# EAGLE design Car (EAGLE 9.2.0)
COMPANY: ADAFRUIT INDUSTRIES; DRAWN: KTOWN; REV: B
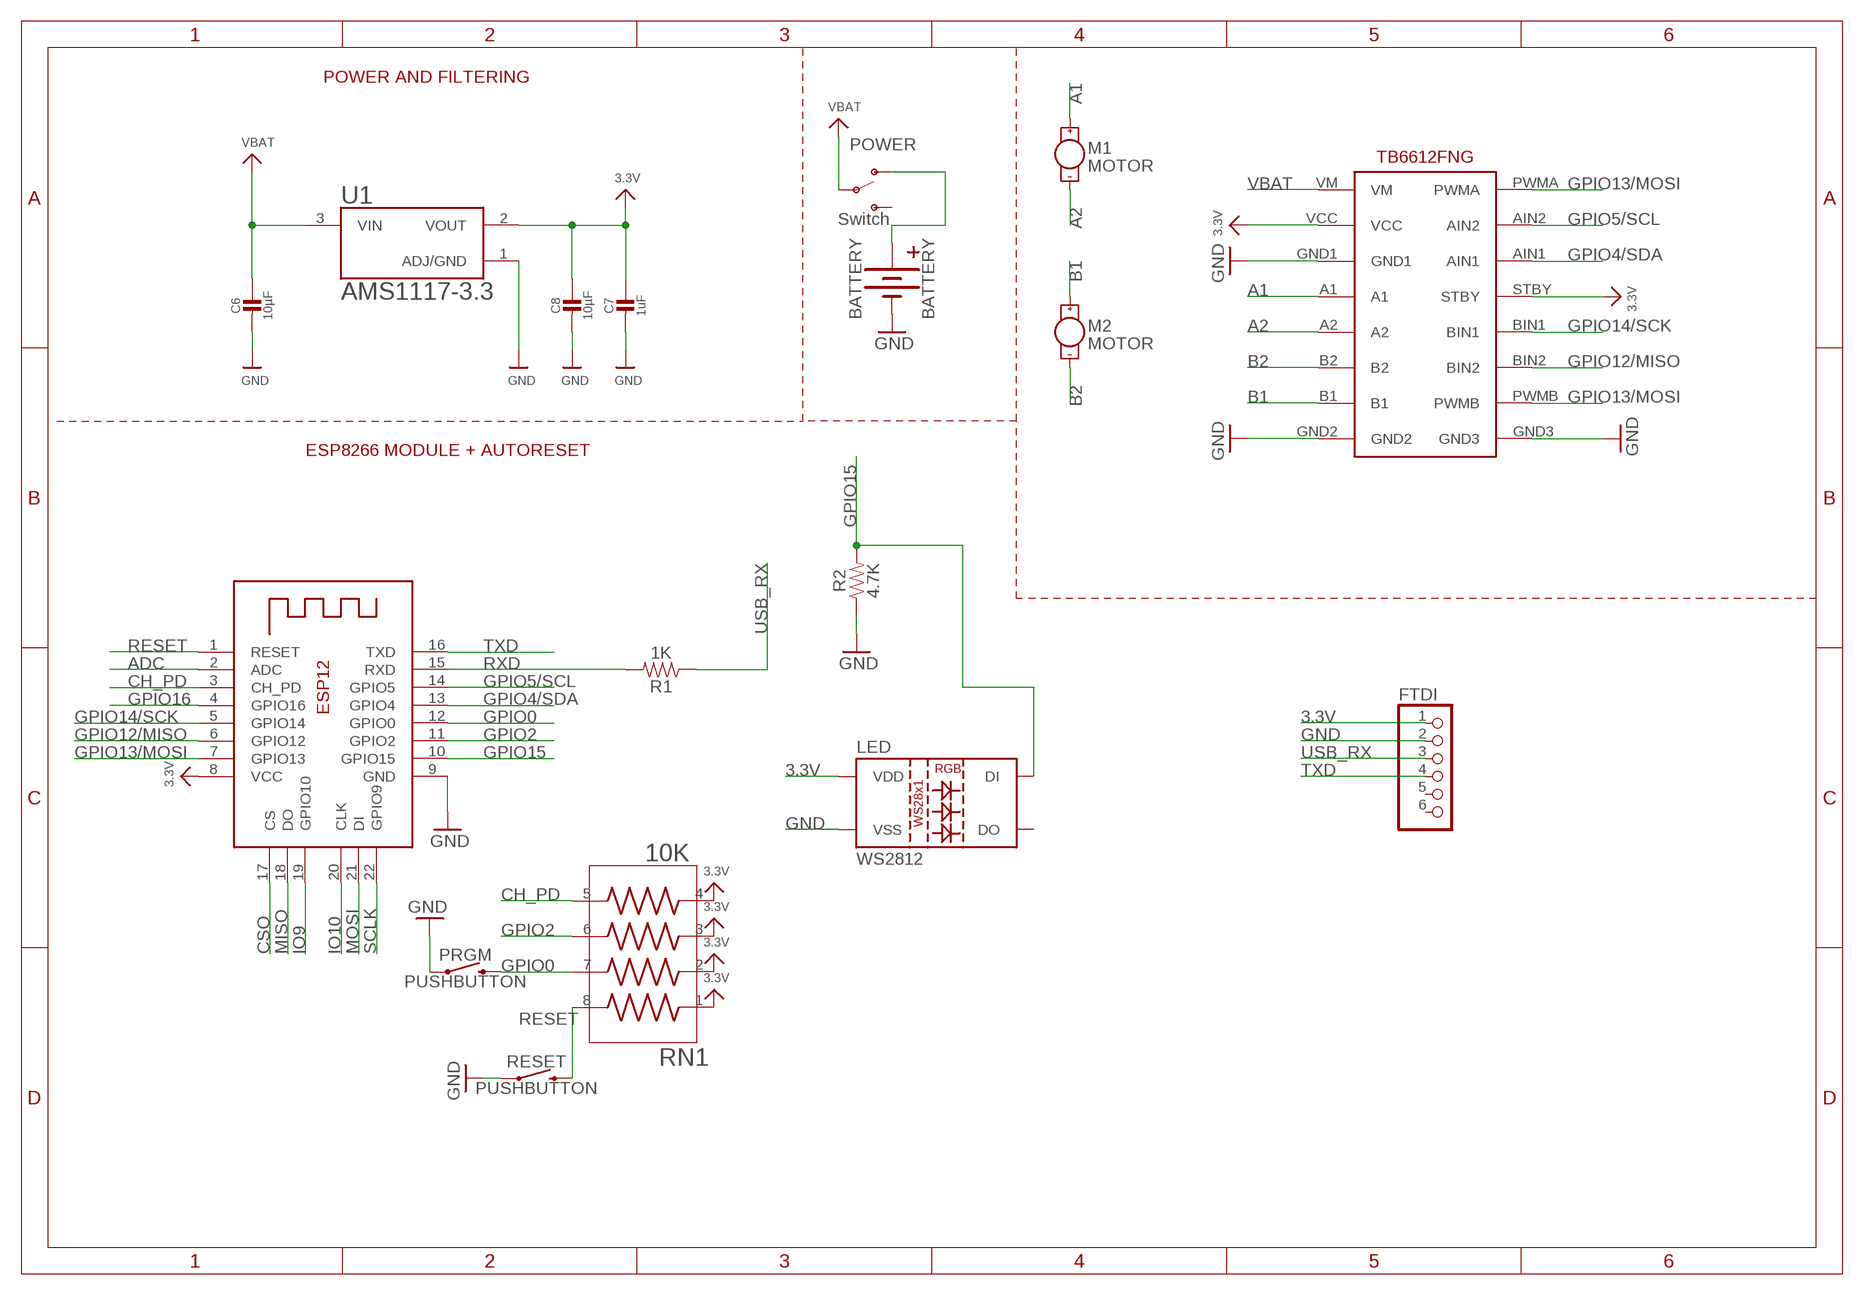
[diagram p0: schematic, sheet 1]

## Parts
BATTERY  BATTERY  [BATTERY-AA-KIT]
C6  10µF  MICROBUILDER_CAP_CERAMIC_0805  [MICROBUILDER__0805]
C7  1uF  MICROBUILDER_CAP_CERAMIC_0603  [MICROBUILDER__0603]
C8  10µF  MICROBUILDER_CAP_CERAMIC_0805  [MICROBUILDER__0805]
FTDI  PINHD-1X6  [1X06]
LED  WS2812  [LED-TRICOLOR-5050-IC]
M1  MOTOR  [1X02_PLUS_MINUS]
M2  MOTOR  [1X02_PLUS_MINUS]
POWER  Switch  SWITCH_SPDT_SLIDE  [SWITCH_SPDT_PTH_11.6X4.0MM]
PRGM  PUSHBUTTON  [TACTILE_SWITCH_SMD_6.0X3.5MM]
R1  1K  RESISTOR1206  [1206]
R2  4.7K  RESISTOR1206  [1206]
RESET  PUSHBUTTON  [TACTILE_SWITCH_SMD_6.0X3.5MM]
RN1  10K  RESISTOR_ARRAY_1206  [RESCAF80P320X160X60-8N]
TB1  TB6612FNG  [TB6612FNG]
U1  AMS1117-3.3  [SOT229P700X180-4N]
X2  ESP-12  ESP-12E  [ESP-12E]

## Nets
3.3V: C7.1 C8.1 FTDI.1 LED.VDD RN1.1 RN1.2 RN1.3 RN1.4 TB1.STBY TB1.VCC U1.2(VOUT) X2.8(VCC)
A1: M1.+ TB1.A1
A2: M1.- TB1.A2
ADC: X2.2(ADC)
B1: M2.+ TB1.B1
B2: M2.- TB1.B2
CH_PD: RN1.5 X2.3(CH_PD)
CSO: X2.17(CS)
GND: BATTERY.GND(-) C6.2 C7.2 C8.2 FTDI.2 LED.VSS PRGM.1 R2.1 RESET.1 TB1.GND1 TB1.GND2 TB1.GND3 U1.1(ADJ/GND) X2.9(GND)
GPIO0: PRGM.2 RN1.7 X2.12(GPIO0)
GPIO2: RN1.6 X2.11(GPIO2)
GPIO4/SDA: TB1.AIN1 X2.13(GPIO4)
GPIO5/SCL: TB1.AIN2 X2.14(GPIO5)
GPIO12/MISO: TB1.BIN2 X2.6(GPIO12)
GPIO13/MOSI: TB1.PWMA TB1.PWMB X2.7(GPIO13)
GPIO14/SCK: TB1.BIN1 X2.5(GPIO14)
GPIO15: LED.DIN(DI) R2.2 X2.10(GPIO15)
GPIO16: X2.4(GPIO16)
IO9: X2.19(GPIO10)
IO10: X2.20(CLK)
MISO: X2.18(DO)
MOSI: X2.21(DI)
N$1: BATTERY.PWR(+) POWER.1(O)
RESET: RESET.2 RN1.8 X2.1(RESET)
RXD: R1.2 X2.15(RXD)
SCLK: X2.22(GPIO9)
TXD: FTDI.4 X2.16(TXD)
USB_RX: FTDI.3 R1.1
VBAT: C6.1 POWER.2(P) TB1.VM U1.3(VIN)
Unconnected: FTDI.5 FTDI.6 LED.DOUT(DO) POWER.3(S)

## Notes on the sheet
- POWER AND FILTERING
- ESP8266 MODULE + AUTORESET

## Library data of the parts
BATTERY = AutoPark:BATTERY
C6-C8 = AutoPark:MICROBUILDER_CAP_CERAMIC: Ceramic Capacitors For new designs, use the packages preceded by an '_' character since they are more reliable: The following footprints should be used on most boards: _0402 - Standard footprint for regular board layouts _0603 - Standard footprint for regular board layouts _0805 - Standard footprint for regular board layouts _1206 - Standard footprint for regular board layouts For extremely tight-pitch boards where space is at a premium, the following 'micro-pitch' footprints can be used (smaller pads, no silkscreen outline, etc.): _0402MP - Micro-pitch footprint for very dense/compact boards _0603MP - Micro-pitch footprint for very dense/compact boards _0805MP - Micro-pitch footprint for very dense/compact boards _1206MP - Micro-pitch footprint for very dense/compact boards
FTDI = pinhead:PINHD-1X6: PIN HEADER
LED = AutoPark:WS2812
M1 M2 = AutoPark:MOTOR
POWER = AutoPark:SWITCH_SPDT_SLIDE: 拨动开关SK12D07VG2/3/4/5/6 侧面5脚拨动带支架 3脚2档柄高6MM Taobao <https://item.taobao.com/item.htm?spm=a1z09.2.0.0.53a62e8d0RVocC&id=563254128682&_u=s1po4ce26496> Dimensional Drawing <https://img.alicdn.com/imgextra/i1/2744920356/TB2568GkMDD8KJjy0FdXXcjvXXa_!!2744920356.jpg>
PRGM RESET = AutoPark:PUSHBUTTON
R1 R2 = SparkFun-Resistors:RESISTOR: Generic Resistor Package
RN1 = AutoPark:RESISTOR_ARRAY_1206: Res Thick Film Array 75 Ohm 5% 0.25W(1/4W) ?200ppm/C ISOL Molded 8-Pin 1206(4 X 0603) Convex SMD T/R; AVAILABILITY: Unavailable; DESCRIPTION: Res Thick Film Array 75 Ohm 5% 0.25W_1/4W_ ?200ppm/C ISOL Molded 8-Pin 1206_4 X 0603_ Convex SMD T/R; MF: Bourns; MP: CAY16-750J4LF; PACKAGE: 1206 Bourns; PRICE: None
TB1 = AutoPark:TB6612FNG
U1 = AutoPark:AMS1117-3.3: Sot223/Pkg 1-Amp 3.3-Volt Low Drop Out Voltage Regulatator; AVAILABILITY: Unavailable; DESCRIPTION: Sot223/Pkg 1-Amp 3.3-Volt Low Drop Out Voltage Regulatator; MF: Advanced Monolithic Systems; MP: AMS1117-3.3; PACKAGE: None; PRICE: None
X2 = microbuilder:ESP-12E

## Board
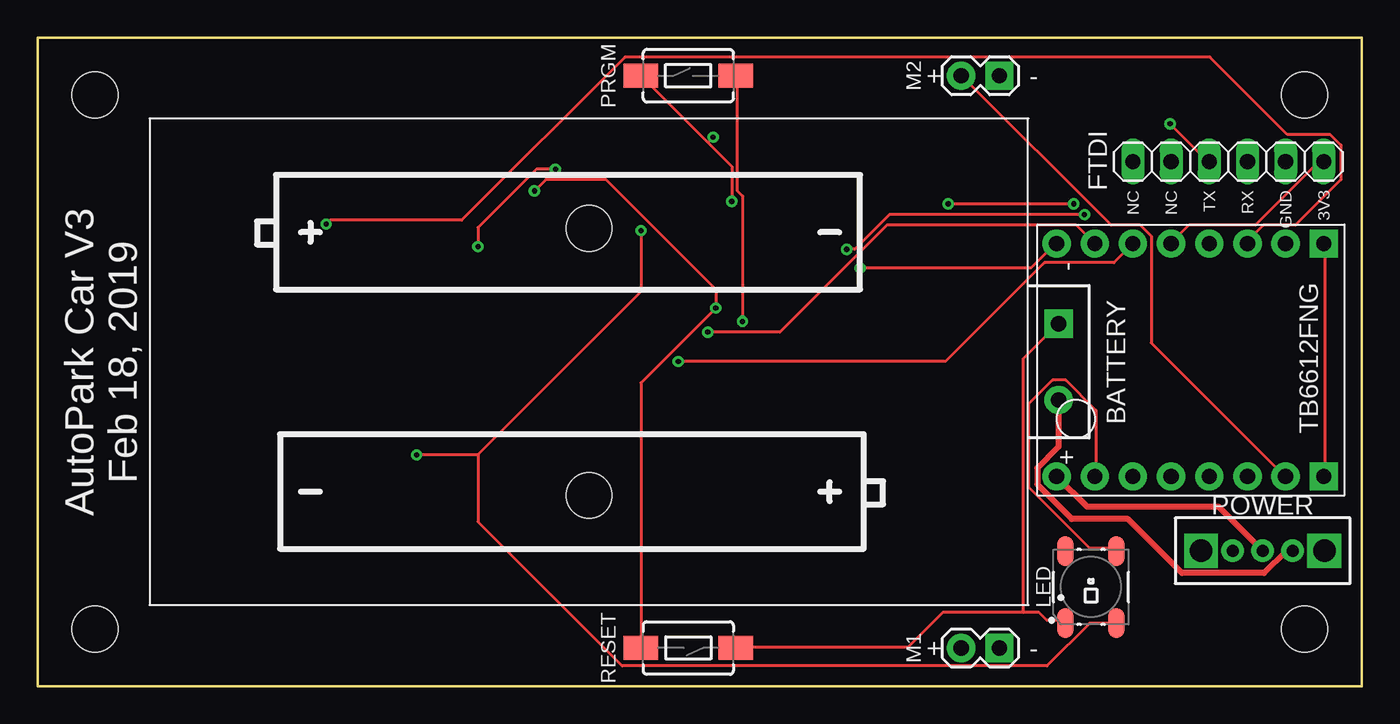
[diagram p1: board, top side]
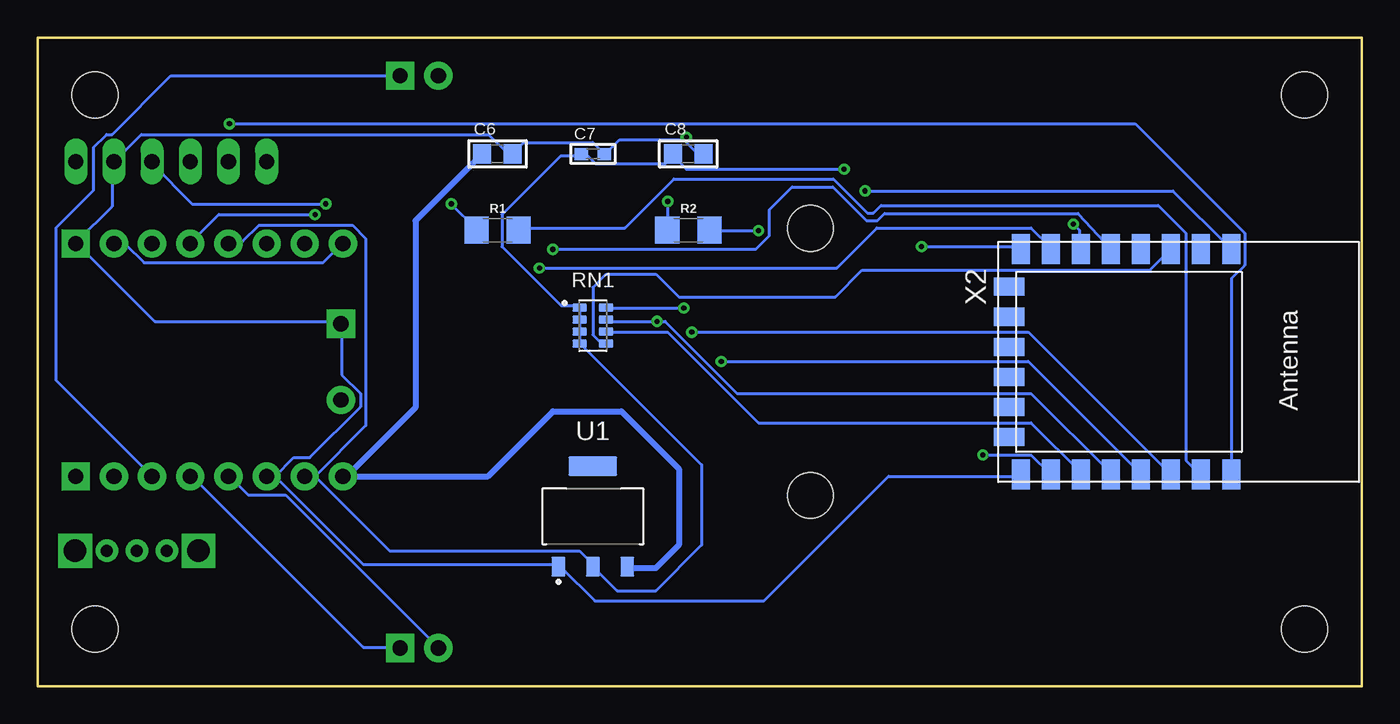
[diagram p2: board, bottom side, seen from below]

Size 88.14 x 43.18 mm. Coordinates in mm from the lower left corner, seen from the top.
Outline: 88.14,43.18 88.14,0 0,0 0,43.18 88.14,43.18
Copper layers (1*16): Top 0.035mm / dielectric 1.5mm / Bottom 0.035mm
Design rules "default *": minimum track width 8mil, minimum drill 0.35mm, track to track 6mil, track to pad 6mil, pad to pad 6mil, via to via 6mil, smd to smd 6mil, copper to edge 40mil, drill to drill 6mil, minimum pad ring 10mil, minimum via ring 8mil, stop-mask expansion 4mil, vias tented up to drill 15mil, thermal gap 10mil
Holes 3.05 mm at 84.33,39.37 3.81,39.37 3.81,3.81 84.33,3.81

### Footprints (pad centres in the part's own frame; a part is rotated, then mirrored left to right if it is on the bottom)
BATTERY-AA-KIT = drill 1.016 pad 1.88 square: GND -31.242,-2.54 | drill 1.016 pad 1.88: PWR -31.242,2.54 | hole 3.048: 0,8.89; 0,-8.89
MICROBUILDER__0805 = smd 1.2 x 1.3: 1 -1.016,0; 2 1.016,0
MICROBUILDER__0603 = smd 0.9 x 0.8: 1 -0.762,0; 2 0.762,0
1X06 = drill 1.016 long: 1 -6.35,0; 2 -3.81,0; 3 -1.27,0; 4 1.27,0; 5 3.81,0; 6 6.35,0
LED-TRICOLOR-5050-IC = smd 2 x 1.1: DIN -2.4,-1.7; DOUT 2.4,1.7; VDD 2.4,-1.7; VSS -2.4,1.7
1X02_PLUS_MINUS = drill 1.016 pad 1.88: + 0,0 | drill 1.016 pad 1.88 square: - 2.54,0
SWITCH_SPDT_PTH_11.6X4.0MM = drill 0.8 pad 1.5: 1 0,2; 2 0,0; 3 0,-2 | drill 1.5 pad 1.8 square: P$1 0,-4.1; P$2 0,4.1
TACTILE_SWITCH_SMD_6.0X3.5MM = smd 2.3 x 1.6: 1 -3.15,0; 2 3.15,0
1206 = smd 1.6 x 1.8: 1 -1.4,0; 2 1.4,0
RESCAF80P320X160X60-8N = smd 0.97 x 0.53: 1 -0.875,1.2; 2 -0.875,0.4; 3 -0.875,-0.4; 4 -0.875,-1.2; 5 0.875,-1.2; 6 0.875,-0.4; 7 0.875,0.4; 8 0.875,1.2
TB6612FNG = drill 1.016 pad 1.88: A1 -7.62,-1.27; A2 -7.62,-3.81; AIN1 7.874,1.27; AIN2 7.874,3.81; B1 -7.62,-8.89; B2 -7.62,-6.35; BIN1 7.874,-3.81; BIN2 7.874,-6.35; GND1 -7.62,1.27; PWMA 7.874,6.35; PWMB 7.874,-8.89; STBY 7.874,-1.27; VCC -7.62,3.81; VM -7.62,6.35 | drill 1.016 pad 1.88 square: GND2 -7.62,-11.43; GND3 7.874,-11.43
SOT229P700X180-4N = smd 0.93 x 1.31: 1 -2.29,-3.345; 2 0,-3.345; 3 2.29,-3.345 | smd 3.24 x 1.31: 4 0,3.345
ESP-12E = smd 2 x 1.2: 1 -7.5,5.77; 2 -7.5,3.77; 3 -7.5,1.77; 4 -7.5,-0.23; 5 -7.5,-2.23; 6 -7.5,-4.23; 7 -7.5,-6.23; 8 -7.5,-8.23; 9 7.5,-8.23; 10 7.5,-6.23; 11 7.5,-4.23; 12 7.5,-2.23; 13 7.5,-0.23; 14 7.5,1.77; 15 7.5,3.77; 16 7.5,5.77 | smd 1.2 x 2: 17 -5,-9; 18 -3,-9; 19 -1,-9; 20 1,-9; 21 3,-9; 22 5,-9

### Placement (x,y rotation side)
BATTERY  36.7,21.59 180 top
C6  57.53,35.43 0 bottom
C7  51.18,35.43 0 bottom
C8  44.83,35.43 0 bottom
FTDI  79.25,34.92 180 top
LED  70.1,6.6 90 top
M1  61.47,2.54 0 top
M2  61.47,40.64 0 top
POWER  81.53,9.02 270 top
PRGM  43.31,40.64 0 top
R1  57.53,30.35 0 bottom
R2  44.83,30.35 0 bottom
RESET  43.31,2.54 180 top
RN1  51.18,24 0 bottom
TB1  74.17,21.59 90 top
U1  51.18,11.3 0 bottom
X2  14.48,21.59 270 bottom

### Tracks (layer width: path | path; a pad name or v marks a point on that pad's centre or on a via)
3.3V  (via drill 0.35)
  Top 0.203: v34.47,34.42 33.2,34.42 29.31,30.53 v29.31,29.26 | FTDI.1 85.5,34.77 85.14,34.77 81.05,30.68 76.61,30.68 75.54,29.62 TB1.STBY | LED.VDD 71.63,9.17 70.03,9.17 65.94,13.26 65.94,18.77 67.54,20.37 68.43,20.37 70.43,18.36 70.43,14.05 TB1.VCC
  Bottom 0.203: 45.85,35.31 46.38,34.77 51,34.77 51.54,35.31 51.89,35.31 C7.1 52.07,35.31 53.32,35.31 57.23,31.39 57.23,29.26 53.32,25.35 52.07,25.35 RN1.1 52.07,25.17 52.07,24.46 RN1.2 52.07,24.28 52.07,23.75 RN1.3 52.07,23.57 52.07,22.86 RN1.4 51.89,22.68 43.94,14.73 43.94,9.4 46.99,6.35 49.57,6.35 U1.2 51.18,8.1 52.07,8.99 64.69,8.99 69.67,13.97 | v29.31,29.26 22.73,29.26 X2.8 | v34.47,34.42 44.96,34.42 45.85,35.31 | C8.1 45.85,35.31 | TB1.VCC 69.67,13.97 | 69.67,13.97 66.29,17.35 66.29,29.79 67.18,30.68 73.41,30.68 74.47,29.62 75.36,29.62 TB1.STBY
A1
  Bottom 0.203: M1.+ 61.49,2.59 71.63,12.72 74.12,12.72 75.36,13.97 TB1.A1
A2
  Bottom 0.203: M1.- 64.16,2.59 66.47,2.59 77.85,13.97 TB1.A2
B1
  Top 0.203: M2.+ 61.49,40.64 71.45,30.68 73.41,30.68 74.12,29.97 74.12,22.86 83.01,13.97 TB1.B1
B2
  Bottom 0.203: M2.- 79.27,40.64 83.18,36.73 83.54,36.73 84.43,35.84 84.43,32.99 86.92,30.5 86.92,20.37 TB1.B2
CH_PD
  Bottom 0.203: RN1.5 50.47,22.86 50.65,22.86 51.18,23.39 51.18,26.54 50.29,27.43 46.99,27.43 45.47,25.91 35.05,25.91 33.27,27.69 14.11,27.69 X2.3
GND  (via drill 0.35)
  Top 0.203: 65.58,4.9 66.65,4.9 67.18,4.37 68.25,4.37 LED.VSS | 65.58,4.9 60.25,4.9 57.94,2.59 46.56,2.59 RESET.1 | v46.2,32.28 46.2,34.59 44.6,36.2 | 44.6,36.2 PRGM.1 | PRGM.1 | v44.96,36.55 44.6,36.2 | TB1.GND2 85.67,13.97 85.67,29.44 TB1.GND3 | 65.58,4.9 65.58,21.79 67.89,24.11 BATTERY.GND
  Bottom 0.203: 72.34,13.97 66.47,8.1 53.49,8.1 U1.1 53.32,7.92 51.05,5.66 39.8,5.66 31.5,13.97 22.73,13.97 X2.9 | TB1.GND1 72.34,13.97 | 72.34,13.97 71.09,15.21 70.03,15.21 66.65,18.59 66.65,19.48 67.89,20.73 67.89,24.11 BATTERY.GND 68.07,24.28 80.34,24.28 85.5,29.44 TB1.GND3 85.5,29.62 83.18,31.93 83.18,34.77 FTDI.2 83.01,34.95 81.23,36.73 58.12,36.73 56.87,35.48 56.52,35.48 | 56.52,35.48 55.8,36.2 51.18,36.2 C7.2 50.29,35.48 49.4,36.37 45.14,36.37 | 45.14,36.37 44.25,35.48 43.89,35.48 C8.2 | v46.2,32.28 46.2,30.5 R2.1 | 45.14,36.37 v44.96,36.55 | 56.52,35.48 C6.2
GPIO0  (via drill 0.35)
  Top 0.203: v46.91,24.28 46.91,32.64 46.56,32.99 46.56,40.64 PRGM.2
  Bottom 0.203: RN1.7 50.29,24.28 v46.91,24.28 46.38,24.28 41.58,19.48 22.02,19.48 16.69,14.15 X2.12
GPIO2
  Bottom 0.203: RN1.6 50.29,23.57 46.2,23.57 40.16,17.53 22.02,17.53 18.64,14.15 X2.11
GPIO4/SDA  (via drill 0.35)
  Top 0.203: v42.65,21.61 60.43,21.61 67,28.19 71.63,28.19 TB1.AIN1
  Bottom 0.203: v42.65,21.61 22.2,21.61 14.73,14.15 X2.13
GPIO5/SCL  (via drill 0.35)
  Top 0.203: v44.6,23.57 49.4,23.57 56.52,30.68 69.14,30.68 TB1.AIN2
  Bottom 0.203: v44.6,23.57 22.2,23.57 12.78,14.15 X2.14
GPIO12/MISO  (via drill 0.35)
  Top 0.203: v19.2,30.76 19.46,31.01 28.22,31.01 39.09,41.88 78.03,41.88 83.18,36.73 86.03,36.73 86.74,36.02 86.74,33.71 83.72,30.68 81.58,30.68 80.52,29.62 TB1.BIN2
  Bottom 0.203: v19.2,30.76 18.82,30.38 18.82,29.26 X2.6
GPIO13/MOSI  (via drill 0.35)
  Top 0.203: v54.74,27.84 66.12,27.84 67.72,29.44 TB1.PWMA
  Bottom 0.203: v54.74,27.84 34.95,27.84 32.28,30.5 22.02,30.5 20.78,29.26 X2.7 | TB1.PWMB 83.01,29.44 82.3,29.44 81.05,28.19 69.14,28.19 67.89,29.44 TB1.PWMA
GPIO14/SCK  (via drill 0.35)
  Top 0.203: v53.85,29.08 54.38,29.08 56.69,31.39 v69.67,31.39
  Bottom 0.203: v53.85,29.08 40.34,29.08 39.45,29.97 39.45,31.7 37.92,33.22 35.2,33.22 32.97,30.99 32.26,30.99 31.78,31.47 18.9,31.47 X2.5 | v69.67,31.39 76.07,31.39 77.85,29.62 TB1.BIN1
GPIO15  (via drill 0.35)
  Top 0.203: 29.29,15.39 40.16,26.26 v40.16,30.33 | 29.29,15.39 v25.22,15.39 | LED.DIN 71.63,4.19 70.03,4.19 67.18,1.35 38.91,1.35 29.31,10.95 29.31,15.39 29.29,15.39
  Bottom 0.203: v40.16,30.33 43.36,30.33 R2.2 | v25.22,15.39 22.02,15.39 20.78,14.15 X2.10
N$1
  Top 0.406: POWER.1 83.1,9.02 81.62,7.54 76.16,7.54 72.57,11.12 68.83,11.12 66.52,13.43 66.52,14.51 67.94,15.93 BATTERY.PWR
RESET  (via drill 0.35)
  Top 0.203: RESET.2 40.16,2.59 40.16,20.19 v45.14,25.17 45.14,26.42 37.82,33.73 33.83,33.73 v33.07,32.97
  Bottom 0.203: v45.14,25.17 50.29,25.17 RN1.8 | v33.07,32.97 12.57,32.97 8.87,29.26 X2.1
RXD
  Bottom 0.203: R1.2 55.98,30.5 49.05,30.5 45.8,33.76 35.18,33.76 32.92,31.5 32.51,31.5 32,32 13.56,32 11.71,30.15 11.71,15.04 10.82,14.15 X2.15
TXD  (via drill 0.35)
  Top 0.203: v75.36,37.44 77.85,34.95 FTDI.4
  Bottom 0.203: v75.36,37.44 15.09,37.44 7.8,30.15 7.8,28.02 8.69,27.13 8.69,14.15 X2.16
USB_RX  (via drill 0.35)
  Top 0.203: v68.96,32.11 v60.6,32.11
  Bottom 0.203: v60.6,32.11 59,30.5 R1.1 | v68.96,32.11 77.85,32.11 80.52,34.77 FTDI.3
VBAT
  Top 0.406: POWER.2 78.61,11.94 69.85,11.94 TB1.VM
  Bottom 0.406: U1.3 48.81,7.87 46.99,7.87 45.47,9.4 45.47,14.48 49.28,18.29 53.85,18.29 58.17,13.97 TB1.VM 67.56,13.97 62.99,18.54 62.99,30.99 C6.1

### Text on the board
tPlace: NC | NC | TX | RX | GND | 3V3 | AutoPark Car V3 / Feb 18, 2019